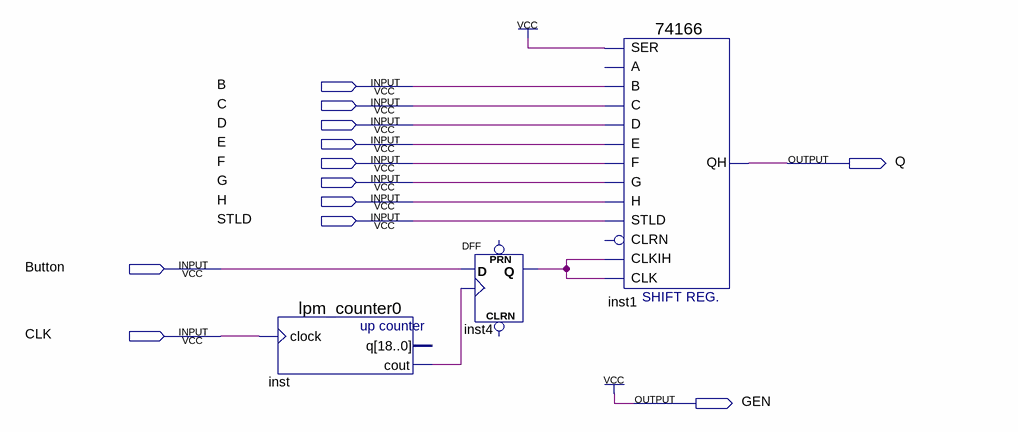
[diagram p0: schematic sheet]
// Quartus schematic lab5-2.bdf as structural Verilog: 3 symbols, 12 pins
module \lab5-2  (
  input  B,
  input  C,
  input  D,
  input  E,
  input  F,
  input  G,
  input  H,
  input  STLD,
  input  Button,
  input  CLK,
  output Q,
  output GEN
);

  wire inst4_q, inst_cout;

  lpm_counter0 inst (.clock(CLK), .cout(inst_cout));  // open: q
  DFF inst4 (.CLK(inst_cout), .D(Button), .Q(inst4_q));  // open: CLRN, PRN
  \74166  inst1 (
    .SER(1'b1), .C(C), .D(D), .E(E), .B(B), .STLD(STLD), .H(H), .G(G), .F(F), .CLK(inst4_q), .CLKIH(inst4_q),
    .QH(Q));  // open: A, CLRN

  assign GEN = 1'b1;
endmodule
